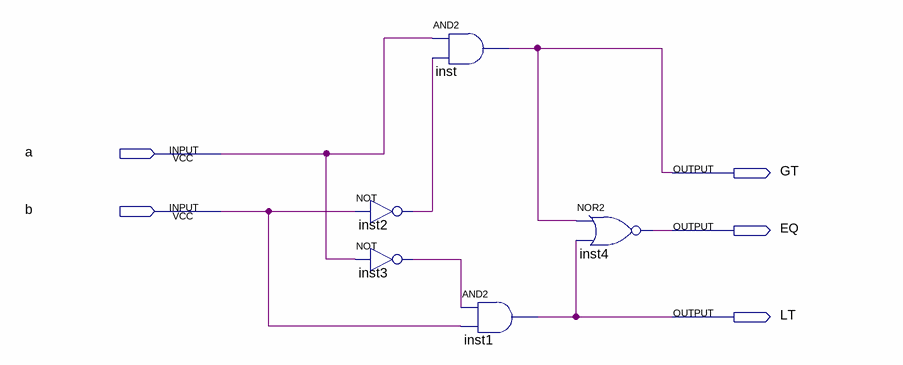
[diagram p0: schematic sheet]
// Quartus schematic Comparator_1bit.bdf as structural Verilog: 5 symbols, 5 pins
module Comparator_1bit (
  input  a,
  input  b,
  output GT,
  output EQ,
  output LT
);

  wire inst2_out, inst3_out;

  not inst2 (inst2_out, b);
  not inst3 (inst3_out, a);
  and inst (GT, a, inst2_out);
  and inst1 (LT, inst3_out, b);
  nor inst4 (EQ, GT, LT);
endmodule
